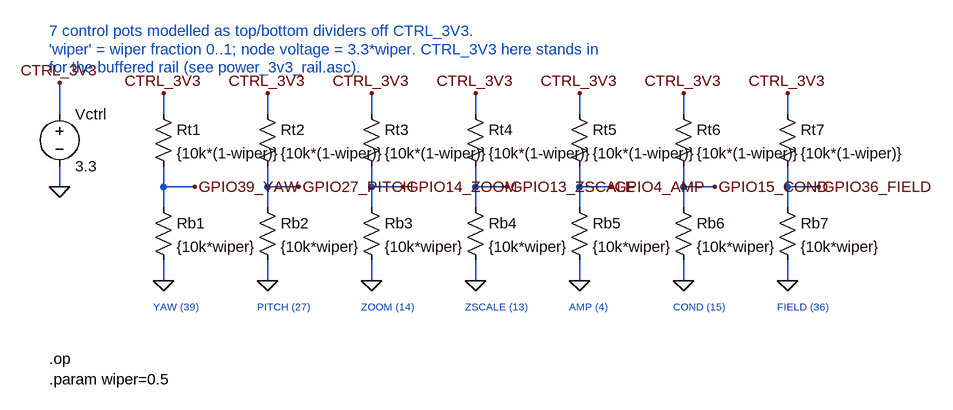
[diagram p0: schematic potentiometers.asc]
potentiometers.asc, the LTspice schematic file:
Version 4
SHEET 1 1280 760
WIRE -144 -32 -144 16
WIRE -144 96 -144 128
WIRE 16 -16 16 16
WIRE 16 96 16 160
WIRE 16 128 64 128
WIRE 16 240 16 272
WIRE 176 -16 176 16
WIRE 176 96 176 160
WIRE 176 128 224 128
WIRE 176 240 176 272
WIRE 336 -16 336 16
WIRE 336 96 336 160
WIRE 336 128 384 128
WIRE 336 240 336 272
WIRE 496 -16 496 16
WIRE 496 96 496 160
WIRE 496 128 544 128
WIRE 496 240 496 272
WIRE 656 -16 656 16
WIRE 656 96 656 160
WIRE 656 128 704 128
WIRE 656 240 656 272
WIRE 816 -16 816 16
WIRE 816 96 816 160
WIRE 816 128 864 128
WIRE 816 240 816 272
WIRE 976 -16 976 16
WIRE 976 96 976 160
WIRE 976 128 1024 128
WIRE 976 240 976 272
FLAG -144 -32 CTRL_3V3
FLAG -144 128 0
FLAG 16 -16 CTRL_3V3
FLAG 64 128 GPIO39_YAW
FLAG 16 272 0
FLAG 176 -16 CTRL_3V3
FLAG 224 128 GPIO27_PITCH
FLAG 176 272 0
FLAG 336 -16 CTRL_3V3
FLAG 384 128 GPIO14_ZOOM
FLAG 336 272 0
FLAG 496 -16 CTRL_3V3
FLAG 544 128 GPIO13_ZSCALE
FLAG 496 272 0
FLAG 656 -16 CTRL_3V3
FLAG 704 128 GPIO4_AMP
FLAG 656 272 0
FLAG 816 -16 CTRL_3V3
FLAG 864 128 GPIO15_COND
FLAG 816 272 0
FLAG 976 -16 CTRL_3V3
FLAG 1024 128 GPIO36_FIELD
FLAG 976 272 0
SYMBOL voltage -144 0 R0
SYMATTR InstName Vctrl
SYMATTR Value 3.3
SYMBOL res 0 0 R0
SYMATTR InstName Rt1
SYMATTR Value {10k*(1-wiper)}
SYMBOL res 0 144 R0
SYMATTR InstName Rb1
SYMATTR Value {10k*wiper}
SYMBOL res 160 0 R0
SYMATTR InstName Rt2
SYMATTR Value {10k*(1-wiper)}
SYMBOL res 160 144 R0
SYMATTR InstName Rb2
SYMATTR Value {10k*wiper}
SYMBOL res 320 0 R0
SYMATTR InstName Rt3
SYMATTR Value {10k*(1-wiper)}
SYMBOL res 320 144 R0
SYMATTR InstName Rb3
SYMATTR Value {10k*wiper}
SYMBOL res 480 0 R0
SYMATTR InstName Rt4
SYMATTR Value {10k*(1-wiper)}
SYMBOL res 480 144 R0
SYMATTR InstName Rb4
SYMATTR Value {10k*wiper}
SYMBOL res 640 0 R0
SYMATTR InstName Rt5
SYMATTR Value {10k*(1-wiper)}
SYMBOL res 640 144 R0
SYMATTR InstName Rb5
SYMATTR Value {10k*wiper}
SYMBOL res 800 0 R0
SYMATTR InstName Rt6
SYMATTR Value {10k*(1-wiper)}
SYMBOL res 800 144 R0
SYMATTR InstName Rb6
SYMATTR Value {10k*wiper}
SYMBOL res 960 0 R0
SYMATTR InstName Rt7
SYMATTR Value {10k*(1-wiper)}
SYMBOL res 960 144 R0
SYMATTR InstName Rb7
SYMATTR Value {10k*wiper}
TEXT -160 -112 Left 2 ;7 control pots modelled as top/bottom dividers off CTRL_3V3.
TEXT -160 -84 Left 2 ;'wiper' = wiper fraction 0..1; node voltage = 3.3*wiper. CTRL_3V3 here stands in
TEXT -160 -56 Left 2 ;for the buffered rail (see power_3v3_rail.asc).
TEXT 0 312 Left 1 ;YAW (39)
TEXT 160 312 Left 1 ;PITCH (27)
TEXT 320 312 Left 1 ;ZOOM (14)
TEXT 480 312 Left 1 ;ZSCALE (13)
TEXT 640 312 Left 1 ;AMP (4)
TEXT 800 312 Left 1 ;COND (15)
TEXT 960 312 Left 1 ;FIELD (36)
TEXT -160 392 Left 2 !.op
TEXT -160 424 Left 2 !.param wiper=0.5

The netlist it stands for:
* potentiometers.asc
Vctrl CTRL_3V3 0 3.3
Rt1 CTRL_3V3 GPIO39_YAW {10k*(1-wiper)}
Rb1 GPIO39_YAW 0 {10k*wiper}
Rt2 CTRL_3V3 GPIO27_PITCH {10k*(1-wiper)}
Rb2 GPIO27_PITCH 0 {10k*wiper}
Rt3 CTRL_3V3 GPIO14_ZOOM {10k*(1-wiper)}
Rb3 GPIO14_ZOOM 0 {10k*wiper}
Rt4 CTRL_3V3 GPIO13_ZSCALE {10k*(1-wiper)}
Rb4 GPIO13_ZSCALE 0 {10k*wiper}
Rt5 CTRL_3V3 GPIO4_AMP {10k*(1-wiper)}
Rb5 GPIO4_AMP 0 {10k*wiper}
Rt6 CTRL_3V3 GPIO15_COND {10k*(1-wiper)}
Rb6 GPIO15_COND 0 {10k*wiper}
Rt7 CTRL_3V3 GPIO36_FIELD {10k*(1-wiper)}
Rb7 GPIO36_FIELD 0 {10k*wiper}
* 7 control pots modelled as top/bottom dividers off CTRL_3V3.
* 'wiper' = wiper fraction 0..1; node voltage = 3.3*wiper. CTRL_3V3 here stands in
* for the buffered rail (see power_3v3_rail.asc).
* YAW (39)
* PITCH (27)
* ZOOM (14)
* ZSCALE (13)
* AMP (4)
* COND (15)
* FIELD (36)
.op
.param wiper=0.5
.backanno
.end